# Altium schematic sheet Sheet1.SchDoc
size A2
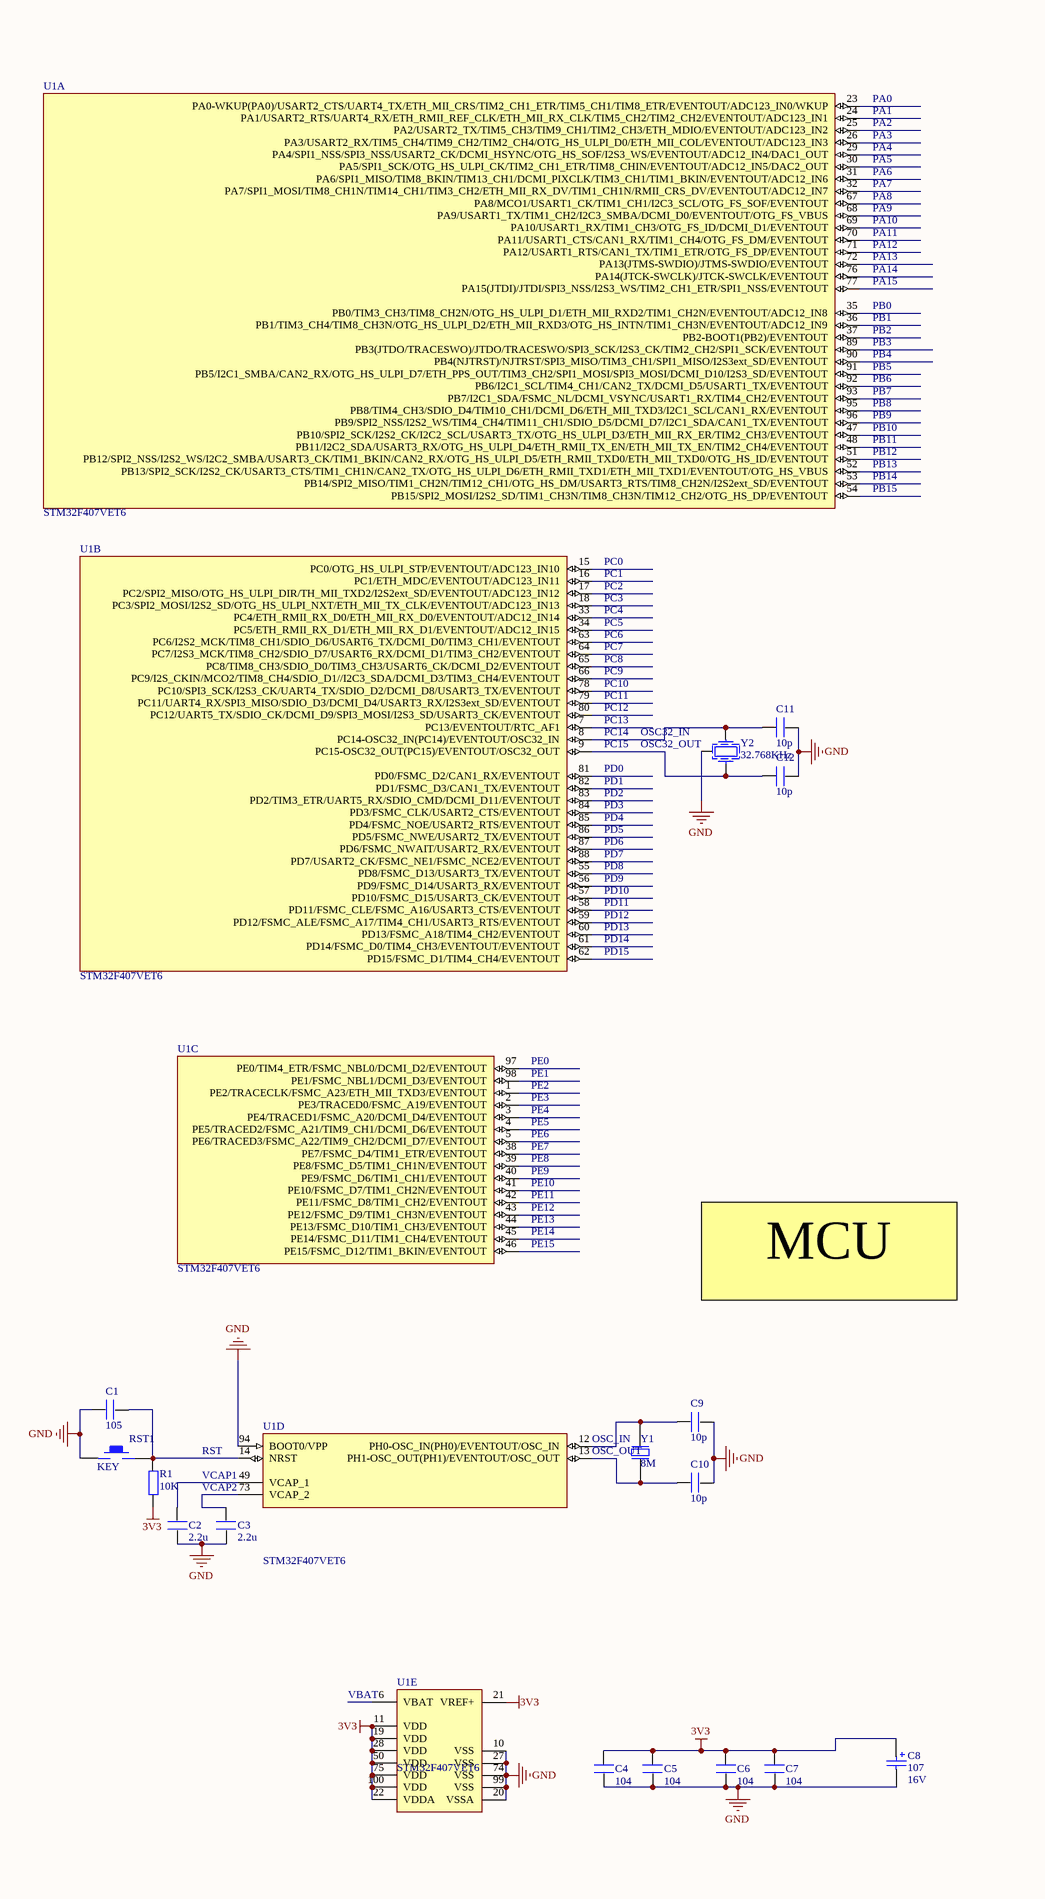
[diagram p0: Sheet1.SchDoc, left]
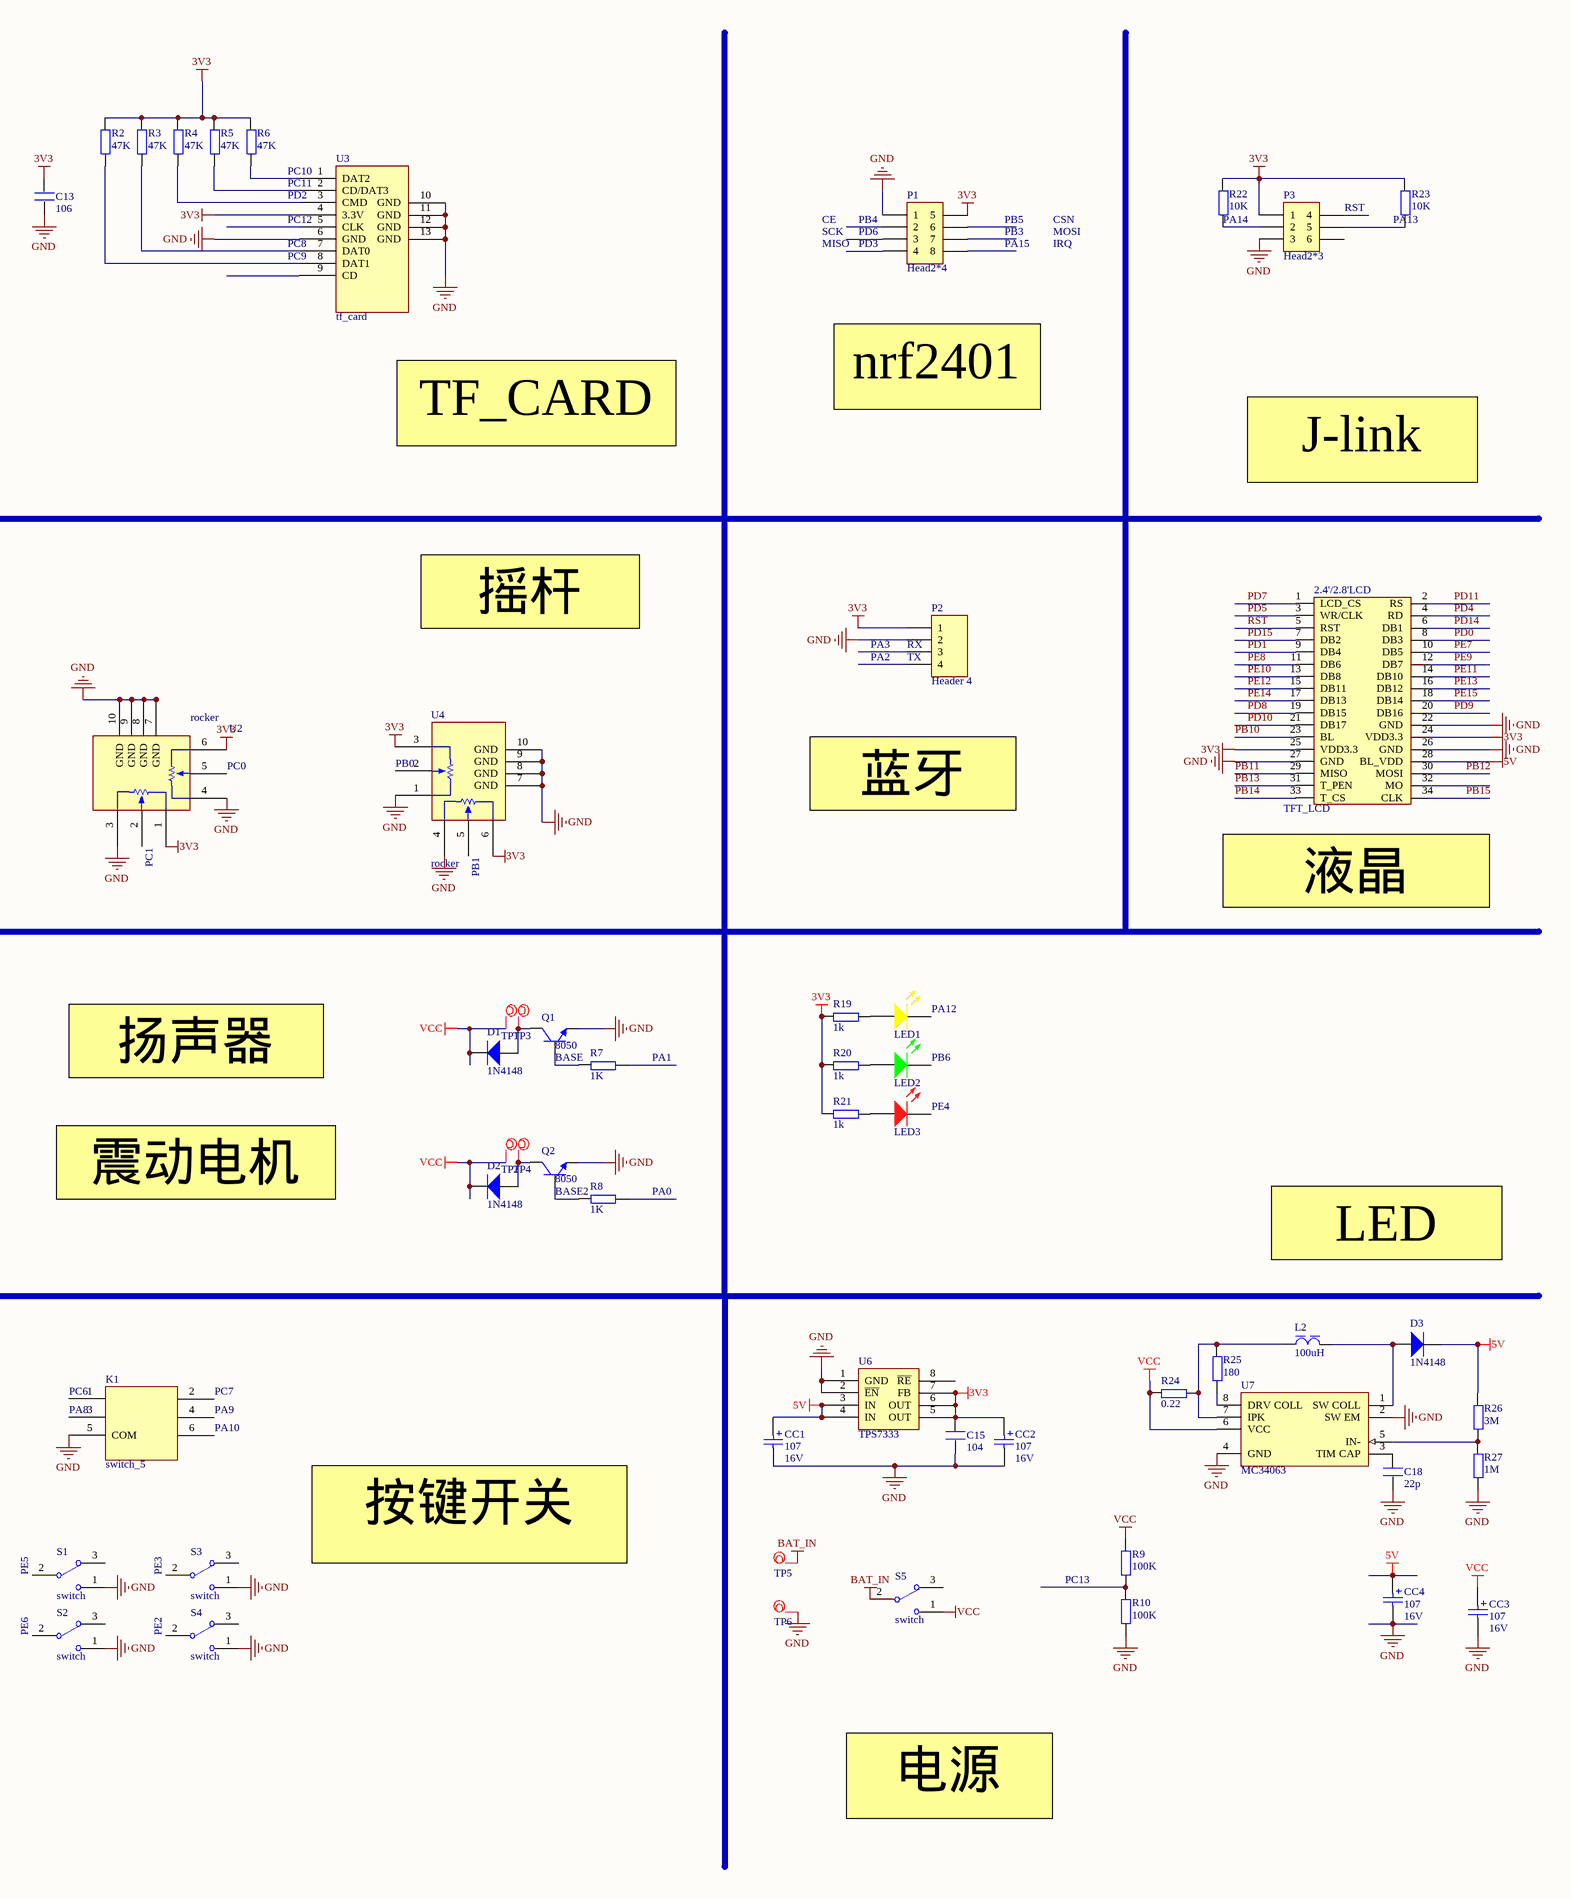
[diagram p1: Sheet1.SchDoc, right]

## Parts
2.4'/2.8'LCD  TFT_LCD  [HDR2X17]
C1  105  [0805C]
C2  2.2u  [0805C]
C3  2.2u  [0805C]
C4  104  [0805C]
C5  104  [0805C]
C6  104  [0805C]
C7  104  [0805C]
C8  Voltage: 16V  [CAPT6032]  (hidden comment: 107)
C9  10p  [0805C]
C10  10p  [0805C]
C11  10p  [0805C]
C12  10p  [0805C]
C13  106  [0805C]
C15  104  [0805C]
C18  22p  [0805C]
CC1  Voltage: 16V  [CAPT6032]  (hidden comment: 107)
CC2  Voltage: 16V  [CAPT6032]  (hidden comment: 107)
CC3  Voltage: 16V  [CAPT6032]  (hidden comment: 107)
CC4  Voltage: 16V  [CAPT6032]  (hidden comment: 107)
D1  1N4148  [SOD-80[LL-34]]
D2  1N4148  [SOD-80[LL-34]]
D3  1N4148  [SOD-80[LL-34]]
K1  switch_5  [switch_5]
L2  100uH  [CD75]
LED1  LED 3Y  [LED-R3-H5-SINGLE-Y]  (value not drawn)
LED2  LED 3G  [LED-R3-H5-SINGLE-G]  (value not drawn)
LED3  LED 3R  [LED-R3-H5-SINGLE-R]  (value not drawn)
P1  Head2*4  [Header2x4_chip]
P2  Header 4  [HX2.54V-4]
P3  Head2*3  [Header2x3_chip]
Q1  8050  [SOT23]
Q2  8050  [SOT23]
R1  10K  [0805R]
R2  47K  [0805R]
R3  47K  [0805R]
R4  47K  [0805R]
R5  47K  [0805R]
R6  47K  [0805R]
R7  1K  [0805R]
R8  1K  [0805R]
R9  100K  [0805R]
R10  100K  [0805R]
R19  1k  [0805R]
R20  1k  [0805R]
R21  1k  [0805R]
R22  10K  [0805R]
R23  10K  [0805R]
R24  0.22  [0805R]
R25  180  [0805R]
R26  3M  [0805R]
R27  1M  [0805R]
RST1  KEY  [KEY]
S1  switch  [switch4]
S2  switch  [switch4]
S3  switch  [switch4]
S4  switch  [switch4]
S5  switch  [swtich3]
TP1  Test Point  [TESTPOINT_PAD_3]  (value not drawn)  (no BOM)
TP2  Test Point  [TESTPOINT_PAD_3]  (value not drawn)  (no BOM)
TP3  Test Point  [TESTPOINT_PAD_3]  (value not drawn)  (no BOM)
TP4  Test Point  [TESTPOINT_PAD_3]  (value not drawn)  (no BOM)
TP5  Test Point  [TESTPOINT_PAD_3]  (value not drawn)  (no BOM)
TP6  Test Point  [TESTPOINT_PAD_3]  (value not drawn)  (no BOM)
U1  STM32F407VET6  [LQFP100_M]  (parts A,B,C,D,E of 5)
U2  rocker  [Rocker]
U3  tf_card  [TF-2]
U4  rocker  [Rocker]
U6  TPS7333  [TPS7333]
U7  MC34063  [SOIC8]
Y1  8M  [XTAL-SMD]
Y2  32.768KHz  [XTAL]

## Nets
3V3: 2.4'/2.8'LCD.24(VDD3.3) 2.4'/2.8'LCD.25(VDD3.3) C4.2 C5.2 C6.2 C7.2 C8.1 C13.2 C15.2 CC2.1 P1.5 P2.1 P3.1 R1.1 R2.2 R3.2 R4.2 R5.2 R6.2 R19.1 R20.1 R21.1 R22.2 R23.2 U1.11(VDD) U1.19(VDD) U1.21(VREF+) U1.22(VDDA) U1.28(VDD) U1.50(VDD) U1.75(VDD) U1.100(VDD) U2.1 U2.6 U3.4(3.3V) U4.3 U4.6 U6.5(OUT) U6.6(OUT) U6.7(FB)
5V: 2.4'/2.8'LCD.28(BL_VDD) CC1.1 CC4.1 D3.K R26.2 U6.3(IN) U6.4(IN)
BAT_IN: S5.2 TP5.1(TP)
GND: 2.4'/2.8'LCD.22(GND) 2.4'/2.8'LCD.26(GND) 2.4'/2.8'LCD.27(GND) C1.1 C2.1 C3.1 C4.1 C5.1 C6.1 C7.1 C8.2 C9.2 C10.2 C11.2 C12.2 C13.1 C15.1 C18.1 CC1.2 CC2.2 CC3.2 CC4.2 K1.5(COM) P1.1 P2.2 P3.3 Q1.2(E) Q2.2(E) R10.1 R27.1 RST1.1 S1.1 S2.1 S3.1 S4.1 TP6.1(TP) U1.10(VSS) U1.20(VSSA) U1.27(VSS) U1.74(VSS) U1.94(BOOT0/VPP) U1.99(VSS) U2.3 U2.4 U2.7(GND) U2.8(GND) U2.9(GND) U2.10(GND) U3.6(GND) U3.10(GND) U3.11(GND) U3.12(GND) U3.13(GND) U4.1 U4.4 U4.7(GND) U4.8(GND) U4.9(GND) U4.10(GND) U6.1(GND) U6.2(~{EN}) U7.2(SW_EM) U7.4(GND) Y2.3
VCC: CC3.1 D1.K D2.K R9.2 R24.1 S5.1 TP1.1(TP) TP2.1(TP) U7.6(VCC)
BASE: Q1.1(B) R7.1
BASE2: Q2.1(B) R8.1
OSC32_IN: C11.1 U1.8(PC14-OSC32_IN(PC14)/EVENTOUT/OSC32_IN) Y2.1  [also labelled PC14]
OSC32_OUT: C12.1 U1.9(PC15-OSC32_OUT(PC15)/EVENTOUT/OSC32_OUT) Y2.2  [also labelled PC15]
OSC_IN: C9.1 U1.12(PH0-OSC_IN(PH0)/EVENTOUT/OSC_IN) Y1.2(OSC2)
OSC_OUT: C10.1 U1.13(PH1-OSC_OUT(PH1)/EVENTOUT/OSC_OUT) Y1.1(OSC1)
PA0: R8.2 U1.23(PA0-WKUP(PA0)/USART2_CTS/UART4_TX/ETH_MII_CRS/TIM2_CH1_ETR/TIM5_CH1/TIM8_ETR/EVENTOUT/ADC123_IN0/WKUP)
PA1: R7.2 U1.24(PA1/USART2_RTS/UART4_RX/ETH_RMII_REF_CLK/ETH_MII_RX_CLK/TIM5_CH2/TIM2_CH2/EVENTOUT/ADC123_IN1)
PA2: P2.4 U1.25(PA2/USART2_TX/TIM5_CH3/TIM9_CH1/TIM2_CH3/ETH_MDIO/EVENTOUT/ADC123_IN2)  [also labelled TX]
PA3: P2.3 U1.26(PA3/USART2_RX/TIM5_CH4/TIM9_CH2/TIM2_CH4/OTG_HS_ULPI_D0/ETH_MII_COL/EVENTOUT/ADC123_IN3)  [also labelled RX]
PA4: U1.29(PA4/SPI1_NSS/SPI3_NSS/USART2_CK/DCMI_HSYNC/OTG_HS_SOF/I2S3_WS/EVENTOUT/ADC12_IN4/DAC1_OUT)
PA5: U1.30(PA5/SPI1_SCK/OTG_HS_ULPI_CK/TIM2_CH1_ETR/TIM8_CHIN/EVENTOUT/ADC12_IN5/DAC2_OUT)
PA6: U1.31(PA6/SPI1_MISO/TIM8_BKIN/TIM13_CH1/DCMI_PIXCLK/TIM3_CH1/TIM1_BKIN/EVENTOUT/ADC12_IN6)
PA7: U1.32(PA7/SPI1_MOSI/TIM8_CH1N/TIM14_CH1/TIM3_CH2/ETH_MII_RX_DV/TIM1_CH1N/RMII_CRS_DV/EVENTOUT/ADC12_IN7)
PA8: K1.3 U1.67(PA8/MCO1/USART1_CK/TIM1_CH1/I2C3_SCL/OTG_FS_SOF/EVENTOUT)
PA9: K1.4 U1.68(PA9/USART1_TX/TIM1_CH2/I2C3_SMBA/DCMI_D0/EVENTOUT/OTG_FS_VBUS)
PA10: K1.6 U1.69(PA10/USART1_RX/TIM1_CH3/OTG_FS_ID/DCMI_D1/EVENTOUT)
PA11: U1.70(PA11/USART1_CTS/CAN1_RX/TIM1_CH4/OTG_FS_DM/EVENTOUT)
PA12: LED1.2(K) U1.71(PA12/USART1_RTS/CAN1_TX/TIM1_ETR/OTG_FS_DP/EVENTOUT)
PA13: P3.5 R23.1 U1.72(PA13(JTMS-SWDIO)/JTMS-SWDIO/EVENTOUT)
PA14: P3.2 R22.1 U1.76(PA14(JTCK-SWCLK)/JTCK-SWCLK/EVENTOUT)
PA15: P1.8 U1.77(PA15(JTDI)/JTDI/SPI3_NSS/I2S3_WS/TIM2_CH1_ETR/SPI1_NSS/EVENTOUT)
PB0: U1.35(PB0/TIM3_CH3/TIM8_CH2N/OTG_HS_ULPI_D1/ETH_MII_RXD2/TIM1_CH2N/EVENTOUT/ADC12_IN8) U4.2
PB1: U1.36(PB1/TIM3_CH4/TIM8_CH3N/OTG_HS_ULPI_D2/ETH_MII_RXD3/OTG_HS_INTN/TIM1_CH3N/EVENTOUT/ADC12_IN9) U4.5
PB2: U1.37(PB2-BOOT1(PB2)/EVENTOUT)
PB3: P1.7 U1.89(PB3(JTDO/TRACESWO)/JTDO/TRACESWO/SPI3_SCK/I2S3_CK/TIM2_CH2/SPI1_SCK/EVENTOUT)
PB4: P1.2 U1.90(PB4(NJTRST)/NJTRST/SPI3_MISO/TIM3_CH1/SPI1_MISO/I2S3ext_SD/EVENTOUT)
PB5: P1.6 U1.91(PB5/I2C1_SMBA/CAN2_RX/OTG_HS_ULPI_D7/ETH_PPS_OUT/TIM3_CH2/SPI1_MOSI/SPI3_MOSI/DCMI_D10/I2S3_SD/EVENTOUT)
PB6: LED2.2(K) U1.92(PB6/I2C1_SCL/TIM4_CH1/CAN2_TX/DCMI_D5/USART1_TX/EVENTOUT)
PB7: U1.93(PB7/I2C1_SDA/FSMC_NL/DCMI_VSYNC/USART1_RX/TIM4_CH2/EVENTOUT)
PB8: U1.95(PB8/TIM4_CH3/SDIO_D4/TIM10_CH1/DCMI_D6/ETH_MII_TXD3/I2C1_SCL/CAN1_RX/EVENTOUT)
PB9: U1.96(PB9/SPI2_NSS/I2S2_WS/TIM4_CH4/TIM11_CH1/SDIO_D5/DCMI_D7/I2C1_SDA/CAN1_TX/EVENTOUT)
PB10: 2.4'/2.8'LCD.23(BL) U1.47(PB10/SPI2_SCK/I2S2_CK/I2C2_SCL/USART3_TX/OTG_HS_ULPI_D3/ETH_MII_RX_ER/TIM2_CH3/EVENTOUT)
PB11: 2.4'/2.8'LCD.29(MISO) U1.48(PB11/I2C2_SDA/USART3_RX/OTG_HS_ULPI_D4/ETH_RMII_TX_EN/ETH_MII_TX_EN/TIM2_CH4/EVENTOUT)
PB12: 2.4'/2.8'LCD.30(MOSI) U1.51(PB12/SPI2_NSS/I2S2_WS/I2C2_SMBA/USART3_CK/TIM1_BKIN/CAN2_RX/OTG_HS_ULPI_D5/ETH_RMII_TXD0/ETH_MII_TXD0/OTG_HS_ID/EVENTOUT)
PB13: 2.4'/2.8'LCD.31(T_PEN) U1.52(PB13/SPI2_SCK/I2S2_CK/USART3_CTS/TIM1_CH1N/CAN2_TX/OTG_HS_ULPI_D6/ETH_RMII_TXD1/ETH_MII_TXD1/EVENTOUT/OTG_HS_VBUS)
PB14: 2.4'/2.8'LCD.33(T_CS) U1.53(PB14/SPI2_MISO/TIM1_CH2N/TIM12_CH1/OTG_HS_DM/USART3_RTS/TIM8_CH2N/I2S2ext_SD/EVENTOUT)
PB15: 2.4'/2.8'LCD.34(CLK) U1.54(PB15/SPI2_MOSI/I2S2_SD/TIM1_CH3N/TIM8_CH3N/TIM12_CH2/OTG_HS_DP/EVENTOUT)
PC0: U1.15(PC0/OTG_HS_ULPI_STP/EVENTOUT/ADC123_IN10) U2.5
PC1: U1.16(PC1/ETH_MDC/EVENTOUT/ADC123_IN11) U2.2
PC2: U1.17(PC2/SPI2_MISO/OTG_HS_ULPI_DIR/TH_MII_TXD2/I2S2ext_SD/EVENTOUT/ADC123_IN12)
PC3: U1.18(PC3/SPI2_MOSI/I2S2_SD/OTG_HS_ULPI_NXT/ETH_MII_TX_CLK/EVENTOUT/ADC123_IN13)
PC4: U1.33(PC4/ETH_RMII_RX_D0/ETH_MII_RX_D0/EVENTOUT/ADC12_IN14)
PC5: U1.34(PC5/ETH_RMII_RX_D1/ETH_MII_RX_D1/EVENTOUT/ADC12_IN15)
PC6: K1.1 U1.63(PC6/I2S2_MCK/TIM8_CH1/SDIO_D6/USART6_TX/DCMI_D0/TIM3_CH1/EVENTOUT)
PC7: K1.2 U1.64(PC7/I2S3_MCK/TIM8_CH2/SDIO_D7/USART6_RX/DCMI_D1/TIM3_CH2/EVENTOUT)
PC8: R3.1 U1.65(PC8/TIM8_CH3/SDIO_D0/TIM3_CH3/USART6_CK/DCMI_D2/EVENTOUT) U3.7(DAT0)
PC9: R2.1 U1.66(PC9/I2S_CKIN/MCO2/TIM8_CH4/SDIO_D1//I2C3_SDA/DCMI_D3/TIM3_CH4/EVENTOUT) U3.8(DAT1)
PC10: R6.1 U1.78(PC10/SPI3_SCK/I2S3_CK/UART4_TX/SDIO_D2/DCMI_D8/USART3_TX/EVENTOUT) U3.1(DAT2)
PC11: R5.1 U1.79(PC11/UART4_RX/SPI3_MISO/SDIO_D3/DCMI_D4/USART3_RX/I2S3ext_SD/EVENTOUT) U3.2(CD/DAT3)
PC12: U1.80(PC12/UART5_TX/SDIO_CK/DCMI_D9/SPI3_MOSI/I2S3_SD/USART3_CK/EVENTOUT) U3.5(CLK)
PC13: R9.1 R10.2 U1.7(PC13/EVENTOUT/RTC_AF1)
PD0: 2.4'/2.8'LCD.8(DB3) U1.81(PD0/FSMC_D2/CAN1_RX/EVENTOUT)
PD1: 2.4'/2.8'LCD.9(DB4) U1.82(PD1/FSMC_D3/CAN1_TX/EVENTOUT)
PD2: R4.1 U1.83(PD2/TIM3_ETR/UART5_RX/SDIO_CMD/DCMI_D11/EVENTOUT) U3.3(CMD)
PD3: P1.4 U1.84(PD3/FSMC_CLK/USART2_CTS/EVENTOUT)
PD4: 2.4'/2.8'LCD.4(RD) U1.85(PD4/FSMC_NOE/USART2_RTS/EVENTOUT)
PD5: 2.4'/2.8'LCD.3(WR/CLK) U1.86(PD5/FSMC_NWE/USART2_TX/EVENTOUT)
PD6: P1.3 U1.87(PD6/FSMC_NWAIT/USART2_RX/EVENTOUT)
PD7: 2.4'/2.8'LCD.1(LCD_CS) U1.88(PD7/USART2_CK/FSMC_NE1/FSMC_NCE2/EVENTOUT)
PD8: 2.4'/2.8'LCD.19(DB15) U1.55(PD8/FSMC_D13/USART3_TX/EVENTOUT)
PD9: 2.4'/2.8'LCD.20(DB16) U1.56(PD9/FSMC_D14/USART3_RX/EVENTOUT)
PD10: 2.4'/2.8'LCD.21(DB17) U1.57(PD10/FSMC_D15/USART3_CK/EVENTOUT)
PD11: 2.4'/2.8'LCD.2(RS) U1.58(PD11/FSMC_CLE/FSMC_A16/USART3_CTS/EVENTOUT)
PD12: U1.59(PD12/FSMC_ALE/FSMC_A17/TIM4_CH1/USART3_RTS/EVENTOUT)
PD13: U1.60(PD13/FSMC_A18/TIM4_CH2/EVENTOUT)
PD14: 2.4'/2.8'LCD.6(DB1) U1.61(PD14/FSMC_D0/TIM4_CH3/EVENTOUT/EVENTOUT)
PD15: 2.4'/2.8'LCD.7(DB2) U1.62(PD15/FSMC_D1/TIM4_CH4/EVENTOUT)
PE0: U1.97(PE0/TIM4_ETR/FSMC_NBL0/DCMI_D2/EVENTOUT)
PE1: U1.98(PE1/FSMC_NBL1/DCMI_D3/EVENTOUT)
PE2: S4.2 U1.1(PE2/TRACECLK/FSMC_A23/ETH_MII_TXD3/EVENTOUT)
PE3: S3.2 U1.2(PE3/TRACED0/FSMC_A19/EVENTOUT)
PE4: LED3.2(K) U1.3(PE4/TRACED1/FSMC_A20/DCMI_D4/EVENTOUT)
PE5: S1.2 U1.4(PE5/TRACED2/FSMC_A21/TIM9_CH1/DCMI_D6/EVENTOUT)
PE6: S2.2 U1.5(PE6/TRACED3/FSMC_A22/TIM9_CH2/DCMI_D7/EVENTOUT)
PE7: 2.4'/2.8'LCD.10(DB5) U1.38(PE7/FSMC_D4/TIM1_ETR/EVENTOUT)
PE8: 2.4'/2.8'LCD.11(DB6) U1.39(PE8/FSMC_D5/TIM1_CH1N/EVENTOUT)
PE9: 2.4'/2.8'LCD.12(DB7) U1.40(PE9/FSMC_D6/TIM1_CH1/EVENTOUT)
PE10: 2.4'/2.8'LCD.13(DB8) U1.41(PE10/FSMC_D7/TIM1_CH2N/EVENTOUT)
PE11: 2.4'/2.8'LCD.14(DB10) U1.42(PE11/FSMC_D8/TIM1_CH2/EVENTOUT)
PE12: 2.4'/2.8'LCD.15(DB11) U1.43(PE12/FSMC_D9/TIM1_CH3N/EVENTOUT)
PE13: 2.4'/2.8'LCD.16(DB12) U1.44(PE13/FSMC_D10/TIM1_CH3/EVENTOUT)
PE14: 2.4'/2.8'LCD.17(DB13) U1.45(PE14/FSMC_D11/TIM1_CH4/EVENTOUT)
PE15: 2.4'/2.8'LCD.18(DB14) U1.46(PE15/FSMC_D12/TIM1_BKIN/EVENTOUT)
RST: 2.4'/2.8'LCD.5(RST) C1.2 P3.4 R1.2 RST1.2 U1.14(NRST)
VBAT: U1.6(VBAT)
VCAP1: C2.2 U1.49(VCAP_1)
VCAP2: C3.2 U1.73(VCAP_2)
NetC18_2: C18.2 U7.3(TIM_CAP)
NetD1_A: D1.A Q1.3(C) TP3.1(TP)
NetD2_A: D2.A Q2.3(C) TP4.1(TP)
NetD3_A: D3.A L2.2 U7.1(SW_COLL)
NetL2_1: L2.1 R24.2 R25.2 U7.7(IPK)
NetLED1_1: LED1.1(A) R19.2
NetLED2_1: LED2.1(A) R20.2
NetLED3_1: LED3.1(A) R21.2
NetR25_1: R25.1 U7.8(DRV_COLL)
NetR26_1: R26.1 R27.2 U7.5(IN-)

Not connected (* = marked no-connect by the designer): 2.4'/2.8'LCD 32(MO); P3 6; S1 3; S2 3; S3 3; S4 3; S5 3; U3 9(CD); U6 8(~{RE})

## Notes on the sheet
- nrf2401
- TF_CARD
- J-link
- 摇杆
- 蓝牙
- (near 2.4'/2.8'LCD) 液晶
- 扬声器
- 震动电机
- LED
- MCU
- 按键开关
- 电源
- Labels drawn without touching a wire or pin: CE, CSN, IRQ, MISO, MOSI, SCK

## Library data of the parts
C1-C7 C9-C13 C15 C18 = C
C8 CC1-CC4 = Cap Tan: Molded (Tantalum) Capacitor, 2-Leads,; Published: 8-Jun-2000; Revision: July-2002: Re-released for DXP Platform.; Publisher: Altium Limited; Price(RMB): 0.000; Value: 107
D1-D3 = Diode 1N4148: SMT Glass Diode, PSpice Model; Imax: 500mA; Published: 8-Jun-2000; Publisher: Altium Limited; Price(RMB): 0.000; PartNumber: 1N4148
L2 = Ind Power: Power Inductor, Ferrite-Core; Imax: 50mA; DCR: .5m; Published: 8-Jun-2000; Revision: July-2002: Re-released for DXP Platform.; Publisher: Altium Limited; Price(RMB): 0.000; Value: 100uH
LED1 = LED 3Y: Yellow, 3mm, Typical INFRARED GaAs LED; Published: 8-Jun-2000; Revision: July-2002: Re-released for DXP Platform.; Publisher: Altium Limited; Price(RMB): 0.00
LED2 = LED 3G: Green, 3mm, Typical INFRARED GaAs LED; Published: 8-Jun-2000; Revision: July-2002: Re-released for DXP Platform.; Publisher: Altium Limited; Price(RMB): 0.00
LED3 = LED 3R: Red, 3mm, Typical INFRARED GaAs LED; Published: 8-Jun-2000; Revision: July-2002: Re-released for DXP Platform.; Publisher: Altium Limited; Price(RMB): 0.00
P1 = Header2x4
P2 = Header 4: Header, 4-Pin; LatestRevisionDate: 17-Jul-2002; LatestRevisionNote: Re-released for DXP Platform.; Publisher: Altium Limited; Price(RMB): 0.00
P3 = Header2x3
Q1 Q2 = NPN BC817-40: NPN Bipolar Transistor; Published: 8-Jun-2000; Revision: July-2002: Re-released for DXP Platform.; Publisher: Altium Limited; Price(RMB): 0.000; PartNumber: 8050
R1-R10 R19-R27 = R
S1-S5 = MIANkey
TP1-TP6 = Test Point: Test Point for Manufature; Price(RMB): 0.000
U1 = STM32F407VET6: ARM Cortex-M4 32b MCU+FPU, 210DMIP, 512 kB Flash, 192+4 kB RAM, Camera, 82 I/Os, 100-pin LQFP, -40 to +85癈, Tray; Internal RAM: 192kB; Operating Frequency (Processor Speed): 168MHz; A/D Converter: 16x12-bit; D/A Converter: 2x12-bit; 16-bit Timers (IC/OC/PWM): 12x16-bit(24/24/30); 32-bit Timer (IC/OC/PWM): 2x32-bit (8/8/8); Other Timer Functions: 2xWDG, RTC, 24-bit down counter; Serial Interface: 3xSPI/2xI2S/2xI2C/3xUSART(IrDa, ISO7816)/3xUART/2xUSB OTG FS/HS, 2xCAN/Ethernet MAC10/100, SDIO; DatasheetVersion: rev2, Jan-2012; PackageVersion: 2012; PackageReference: LQFP100; PackageDescription: 100-Pin Low Profile Quad Flat Package, 14x14 mm Body, 0.5 mm Pitch; ComponentLink1Description: Manufacturer URL; ComponentLink1URL: http://www.st.com/; ComponentLink2Description: STM32F405/7 Datasheet; ComponentLink2URL: http://www.st.com/internet/com/TECHNICAL_RESOURCES/TECHNICAL_LITERATURE/DATASHEET/DM00037051.pdf; ComponentLink3Description: STM32F4 Web Page; ComponentLink3URL: http://www.st.com/internet/mcu/subclass/1521.jsp
U3 = TF- SDIO
U7 = MC34063: DC-to-DC Converter Control Circuit; Price(RMB): 0.0; PartNumber: MC34063
Y1 = XTAL: Crystal Oscillator; Value: 16MHz; Published: 8-Jun-2000; Revision: July-2002: Re-released for DXP Platform.; Publisher: Altium Limited; Price(RMB): 0.000
Y2 = XTAL 3P: 3-pin Crystal Oscillator, Case Shelter; Price(RMB): 0.000; Value: 32.768KHz